# EAGLE design motorsystem_test (EAGLE 9.6.2)
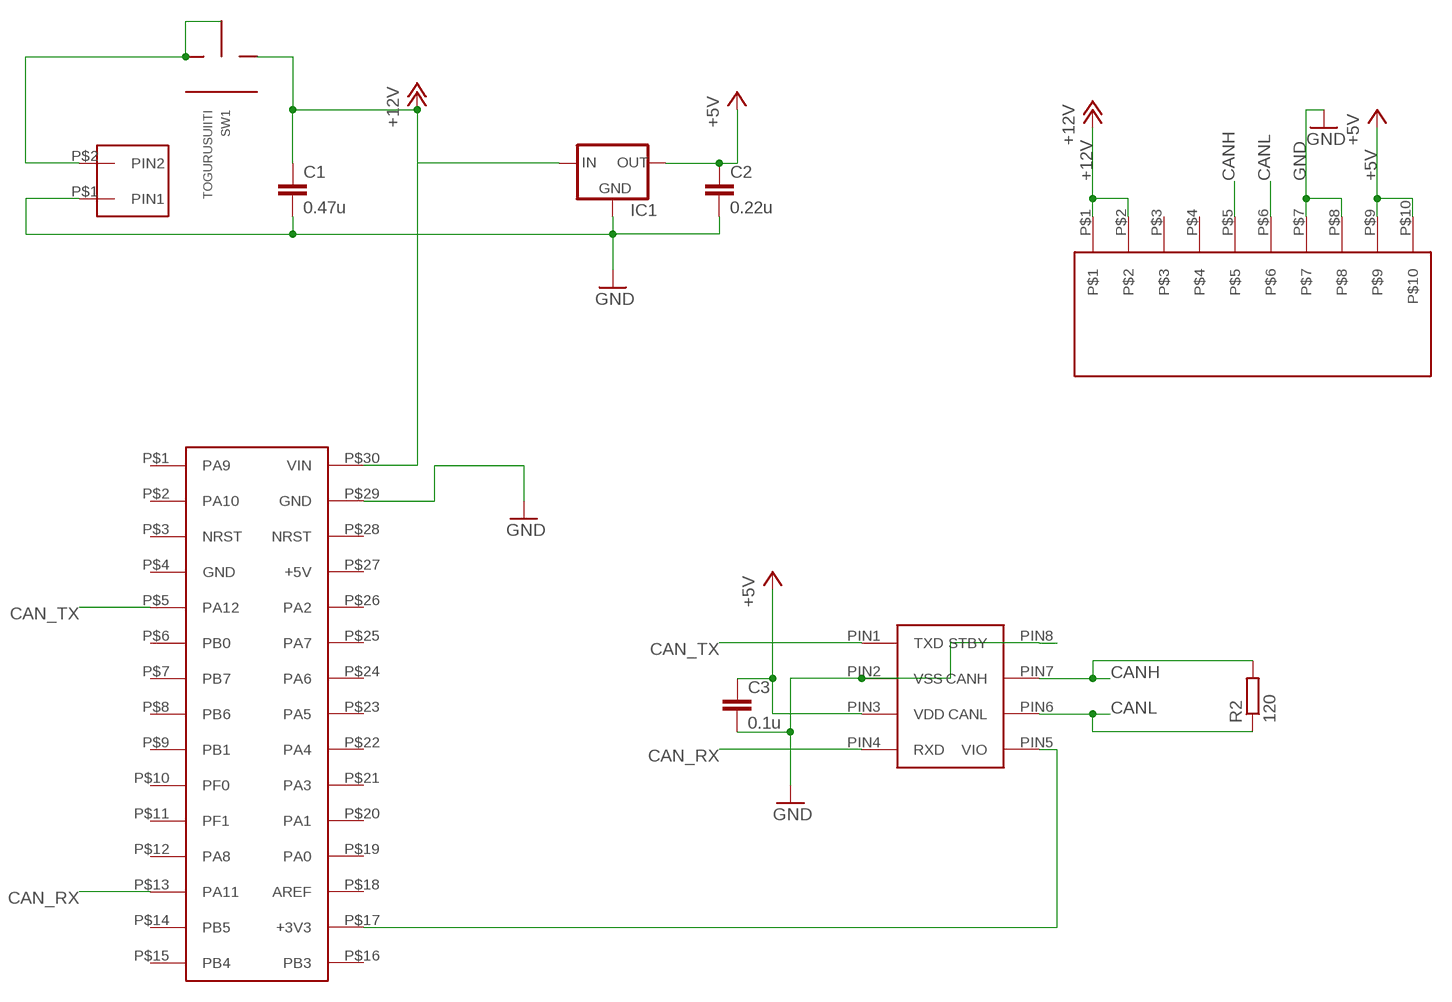
[diagram p0: schematic, sheet 1]

## Parts
C1  0.47u  C-EU025-030X050  [C025-030X050]
C2  0.22u  C-EU025-030X050  [C025-030X050]
C3  0.1u  C-EU025-030X050  [C025-030X050]
IC1  78XXS  [78XXS]
IC2  MCP2562  [DIL8]
R2  120  R-EU_0207/2V  [0207/2V]
SW1  TOGURUSUIITI  [TOGURUSUIITI]
U$1  XH_2P  [XH_2P]
U$2  BOX10PBOX10P-L  [BOX10P-L]
U$3  NUCLEO-F303K8  [NUCLEO-NANO]

## Nets
+5V: C2.1 C3.1 IC1.OUT IC2.PIN3(VDD) U$2.P$9 U$2.P$10
+12V: C1.1 IC1.IN SW1.1 U$2.P$1 U$2.P$2 U$3.P$30(VIN)
CAN_RX: IC2.PIN4(RXD) U$3.P$13(PA11)
CAN_TX: IC2.PIN1(TXD) U$3.P$5(PA12)
CANH: IC2.PIN7(CANH) R2.2 U$2.P$5
CANL: IC2.PIN6(CANL) R2.1 U$2.P$6
GND: C1.2 C2.2 C3.2 IC1.GND IC2.PIN2(VSS) IC2.PIN8(STBY) U$1.P$1(PIN1) U$2.P$7 U$2.P$8 U$3.P$29(GND)
N$1: SW1.2 SW1.C U$1.P$2(PIN2)
N$7: IC2.PIN5(VIO) U$3.P$17(+3V3)
Unconnected: SW1.NC SW1.NC@2(NC) U$2.P$3 U$2.P$4 U$3.P$1(PA9) U$3.P$2(PA10) U$3.P$3(NRST) U$3.P$4(GND) U$3.P$6(PB0) U$3.P$7(PB7) U$3.P$8(PB6) U$3.P$9(PB1) U$3.P$10(PF0) U$3.P$11(PF1) U$3.P$12(PA8) U$3.P$14(PB5) U$3.P$15(PB4) U$3.P$16(PB3) U$3.P$18(AREF) U$3.P$19(PA0) U$3.P$20(PA1) U$3.P$21(PA3) U$3.P$22(PA4) U$3.P$23(PA5) U$3.P$24(PA6) U$3.P$25(PA7) U$3.P$26(PA2) U$3.P$27(+5V) U$3.P$28(NRST)

## Library data of the parts
C1-C3 = rcl:C-EU: CAPACITOR, European symbol; SPICEPREFIX: C
IC1 = v-reg:78XXS: VOLTAGE REGULATOR
IC2 = user_ic:MCP2562
R2 = rcl:R-EU_: RESISTOR, European symbol; SPICEPREFIX: R
SW1 = user_swich:TOGURUSUIITI: 基板用小型3pトグルスイッチ1回路2接点 秋月電子通商通販コード[P-00300]
U$1 = user_conector:XH_2P: トップ型xhコネクタ2ピン 秋月に売ってるやつ
U$2 = user_conector:BOX10P
U$3 = user_ic:NUCLEO-F303K8

## Board
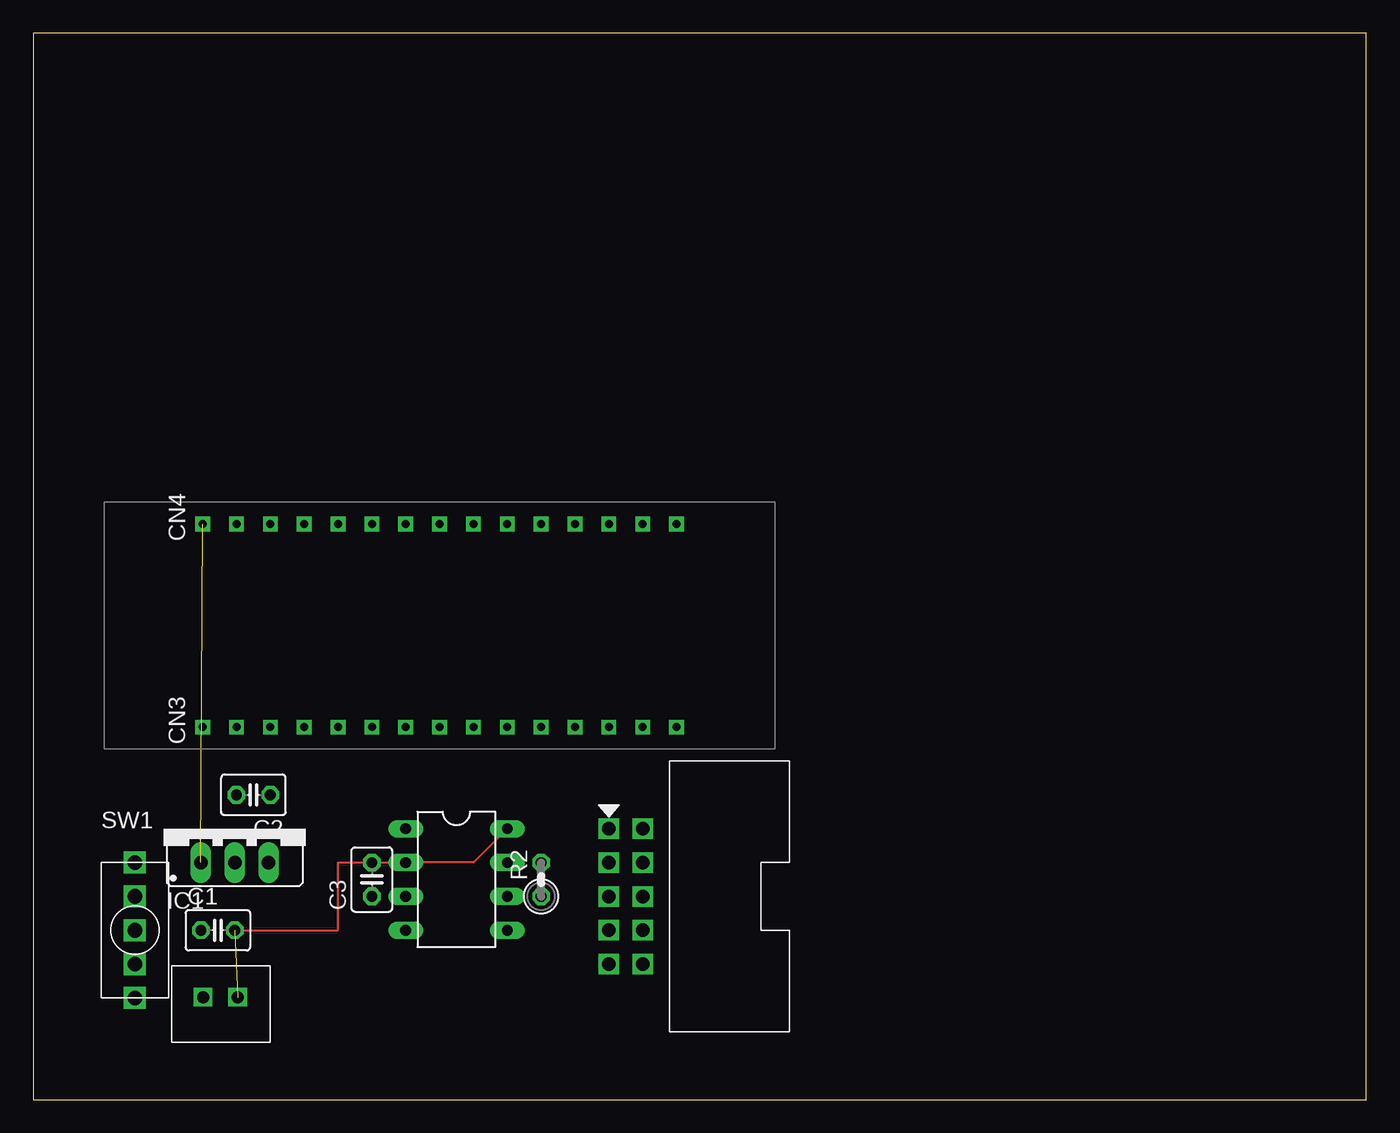
[diagram p1: board, top side]
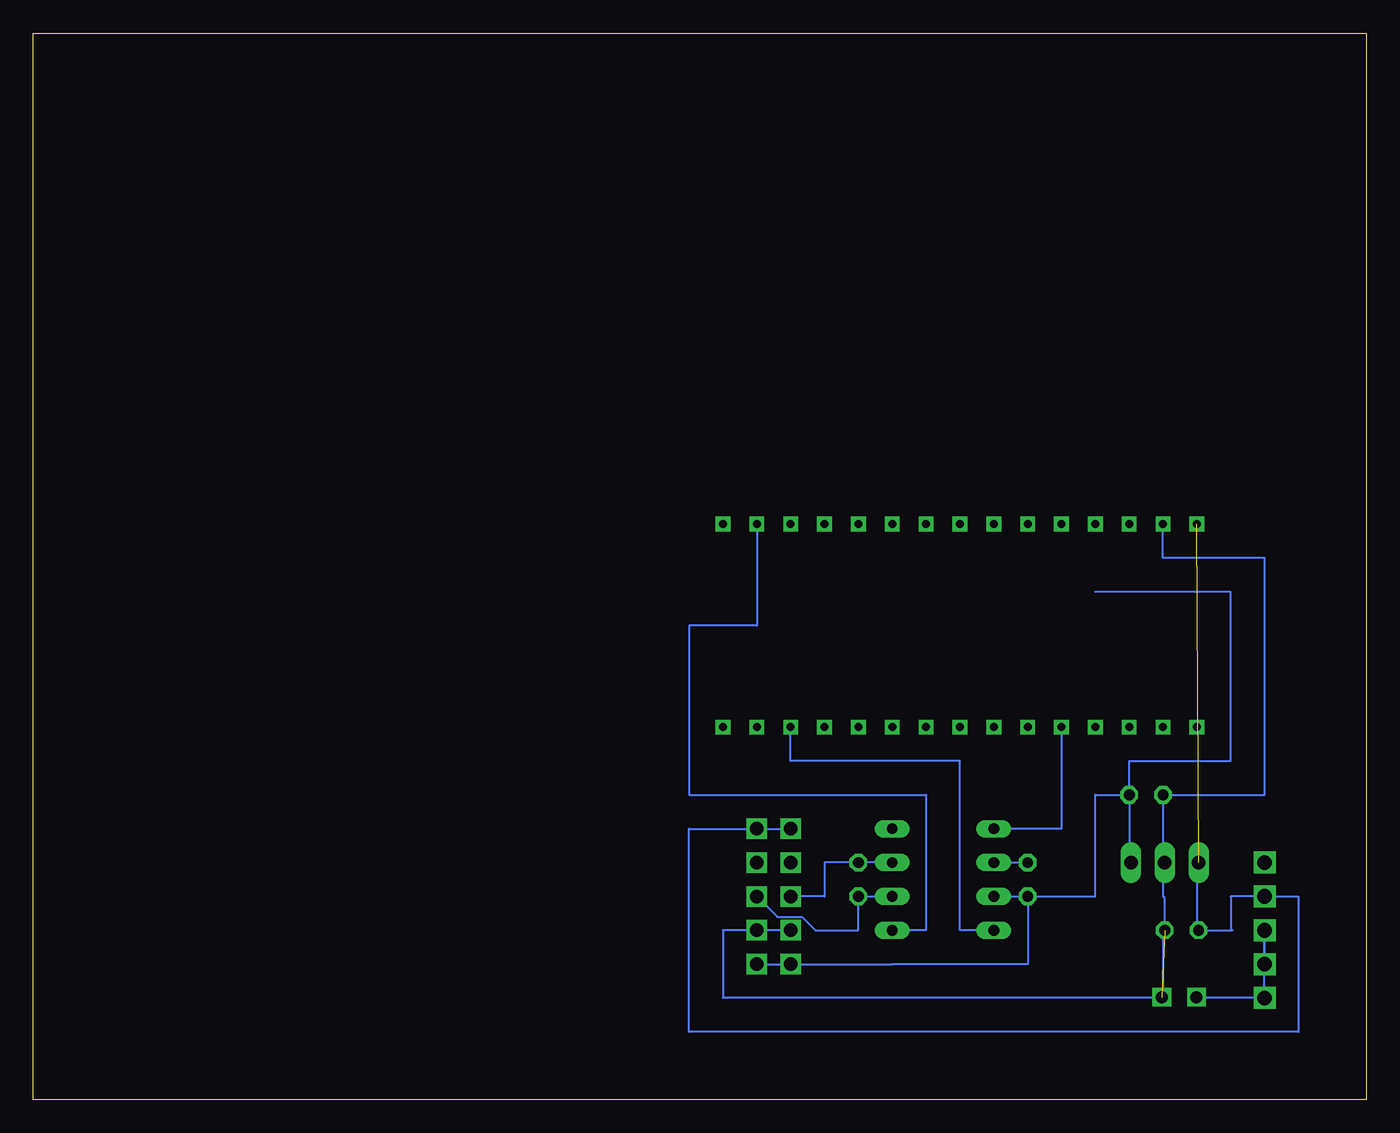
[diagram p2: board, bottom side, seen from below]

Size 100 x 80 mm. Coordinates in mm from the lower left corner, seen from the top.
Outline: 0,0 100,0 100,80 0,80 0,0
Copper layers (1*16): Top 0.035mm / dielectric 1.5mm / Bottom 0.035mm
Design rules "default": minimum track width 6mil, minimum drill 0.35mm, track to track 6mil, track to pad 6mil, pad to pad 6mil, via to via 6mil, smd to smd 6mil, copper to edge 40mil, drill to drill 6mil, minimum pad ring 10mil, minimum via ring 8mil, stop-mask expansion 4mil, vias tented up to drill 0mil, thermal gap 10mil

### Footprints (pad centres in the part's own frame; a part is rotated, then mirrored left to right if it is on the bottom)
C025-030X050 = drill 0.813 octagon: 1 -1.27,0; 2 1.27,0
78XXS = drill 1.016 long: GND 0,-2.54; IN -2.54,-2.54; OUT 2.54,-2.54
DIL8 = drill 0.813 long: PIN1 -3.81,-3.81; PIN2 -1.27,-3.81; PIN3 1.27,-3.81; PIN4 3.81,-3.81; PIN5 3.81,3.81; PIN6 1.27,3.81; PIN7 -1.27,3.81; PIN8 -3.81,3.81
0207/2V = drill 0.813 octagon: 1 -1.27,0; 2 1.27,0
TOGURUSUIITI = drill 1.1 square: 1 0,2.54; 2 0,-2.54; C 0,0; NC 0,5.08; NC@2 0,-5.08
XH_2P = drill 0.9 square: P$1 2.45,2.35; P$2 5.05,2.35
BOX10P-L = drill 1.02 square: P$1 5.08,2.54; P$2 5.08,0; P$3 2.54,2.54; P$4 2.54,0; P$5 0,2.54; P$6 0,0; P$7 -2.54,2.54; P$8 -2.54,0; P$9 -5.08,2.54; P$10 -5.08,0
NUCLEO-NANO = drill 0.6 square: P$1 -7.62,17.78; P$2 -7.62,15.24; P$3 -7.62,12.7; P$4 -7.62,10.16; P$5 -7.62,7.62; P$6 -7.62,5.08; P$7 -7.62,2.54; P$8 -7.62,0; P$9 -7.62,-2.54; P$10 -7.62,-5.08; P$11 -7.62,-7.62; P$12 -7.62,-10.16; P$13 -7.62,-12.7; P$14 -7.62,-15.24; P$15 -7.62,-17.78; P$16 7.62,-17.78; P$17 7.62,-15.24; P$18 7.62,-12.7; P$19 7.62,-10.16; P$20 7.62,-7.62; P$21 7.62,-5.08; P$22 7.62,-2.54; P$23 7.62,0; P$24 7.62,2.54; P$25 7.62,5.08; P$26 7.62,7.62; P$27 7.62,10.16; P$28 7.62,12.7; P$29 7.62,15.24; P$30 7.62,17.78

### Placement (x,y rotation side)
C1  13.84,12.7 0 top
C2  16.51,22.86 180 top
C3  25.4,16.51 90 top
IC1  15.11,20.32 0 top
IC2  31.75,16.51 270 top
R2  38.1,16.51 90 top
SW1  7.62,12.7 0 top
U$1  17.78,10.03 180 top
U$2  45.72,15.24 90 top
U$3  30.48,35.56 90 top

### Tracks (layer width: path | path; a pad name or v marks a point on that pad's centre or on a via)
+5V
  Bottom 0.152: IC2.PIN3 C3.1 | C3.1 25.4,10.16 35.56,10.16 U$2.P$9 U$2.P$10 | C3.1 20.32,15.24 20.32,22.86 C2.1 | 20.32,38.1 10.16,38.1 10.16,25.4 17.78,25.4 C2.1 | C2.1 17.78,17.91 IC1.OUT
+12V  (1 unrouted)
  Bottom 0.152: IC1.IN 12.7,17.65 12.7,12.7 C1.1 10.16,12.7 | SW1.1 7.62,15.11 | 10.16,12.7 10.03,12.7 | SW1.1 5.08,15.24 5.08,5.08 50.8,5.08 50.8,20.32 U$2.P$2 U$2.P$1 | SW1.1 10.16,15.24 10.16,12.7
CAN_RX
  Bottom 0.152: IC2.PIN4 30.48,12.7 30.48,25.4 43.18,25.4 U$3.P$13
CAN_TX
  Bottom 0.152: IC2.PIN1 22.86,20.32 U$3.P$5
CANH
  Bottom 0.152: IC2.PIN7 R2.2 40.64,17.78 40.64,15.24 U$2.P$5
CANL
  Bottom 0.152: IC2.PIN6 R2.1 38.1,12.7 41.33,12.7 42.32,13.69 44.17,13.69 U$2.P$6
GND  (1 unrouted)
  Top 0.152: C1.2 22.86,12.7 22.86,17.78 IC2.PIN2 33.02,17.78 IC2.PIN8
  Bottom 0.152: IC2.PIN2 C3.2 | U$2.P$7 U$2.P$8 48.26,12.7 48.26,7.62 15.24,7.62 15.24,12.57 C1.2 15.11,15.11 15.24,15.24 15.24,17.78 | 15.24,17.78 IC1.GND | 15.24,17.78 C2.2 7.62,22.86 7.62,40.64 15.24,40.64 U$3.P$29
N$1
  Bottom 0.152: SW1.2 SW1.C 7.68,12.64 7.68,7.68 U$1.P$2
N$7
  Bottom 0.152: U$3.P$17 45.72,35.56 50.8,35.56 50.8,22.86 33.02,22.86 33.02,12.7 IC2.PIN5